# Altium schematic sheet Sharp96Lcd.SchDoc
size A4; PageSetup: Record=PageOptions|CenterHorizontal=True|CenterVertical=True|PrintScale=0.97|XCorrection=1.00|YCorrection=1.00|PrintKind=2|BorderSize=5000000|LeftOffset=0|BottomOffset=0|Orientation=2|PaperLength=1000|PaperWidth=1000|Scale=100|PaperSource=7|PrintQuality=-3|MediaType=1|DitherType=10|PrintScaleMode=1|PaperKind=A4|PaperIndex=9
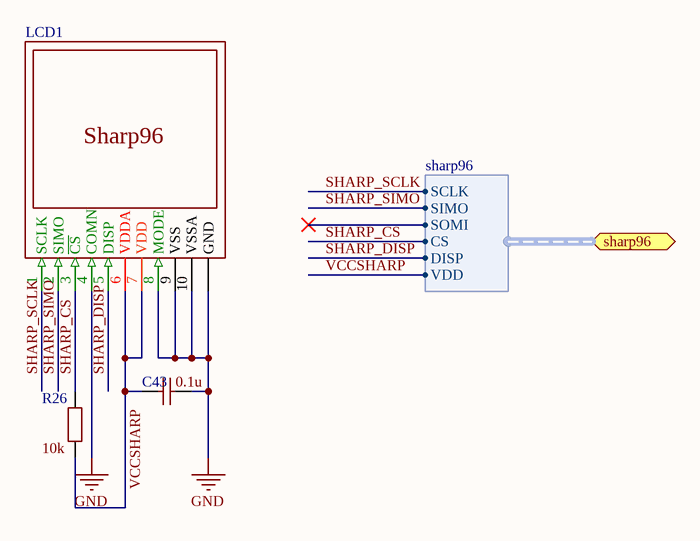
[diagram p0: Sharp96Lcd.SchDoc]

## Parts
C43  value 0.1u  [C0402_h]  (hidden comment: Capacitor)
LCD1  sharp96  [Sharp96]  (value not drawn)
R26  value 10k  [R0402]  (hidden comment: Register)

## Ports
sharp96 (harness sharp96)

## Harnesses
sharp96: SCLK, SIMO, SOMI, CS, DISP, VDD

## Nets
GND: C43.2 LCD1.0(GND) LCD1.4(COMN) LCD1.8(MODE) LCD1.9(VSS) LCD1.10(VSSA)
SHARP_CS: LCD1.3(~{CS}) R26.2 ; port sharp96.CS
SHARP_DISP: LCD1.5(DISP) ; port sharp96.DISP
SHARP_SCLK: LCD1.1(SCLK) ; port sharp96.SCLK
SHARP_SIMO: LCD1.2(SIMO) ; port sharp96.SIMO
VCCSHARP: C43.1 LCD1.6(VDDA) LCD1.7(VDD) R26.1 ; port sharp96.VDD

## Notes on the sheet
- (in symbol LCD_Sharp96) Sharp96

## Library data of the parts
C43 = 贴片电容-无极性: VDC: 10V; Published: 8-Jun-2000; LatestRevisionDate: 17-Jul-2002; LatestRevisionNote: Re-released for DXP Platform.; PackageReference: RAD-0.3; Publisher: Altium Limited; PackageDescription: Radial Cap, Thru-Hole; 2 Leads; 0.3 in Pin Spacing
LCD1 = LCD_Sharp96: sharp96 lcd, 96x96
R26 = 贴片电阻